# EAGLE design md2pce_v20 (EAGLE 6.6.0)
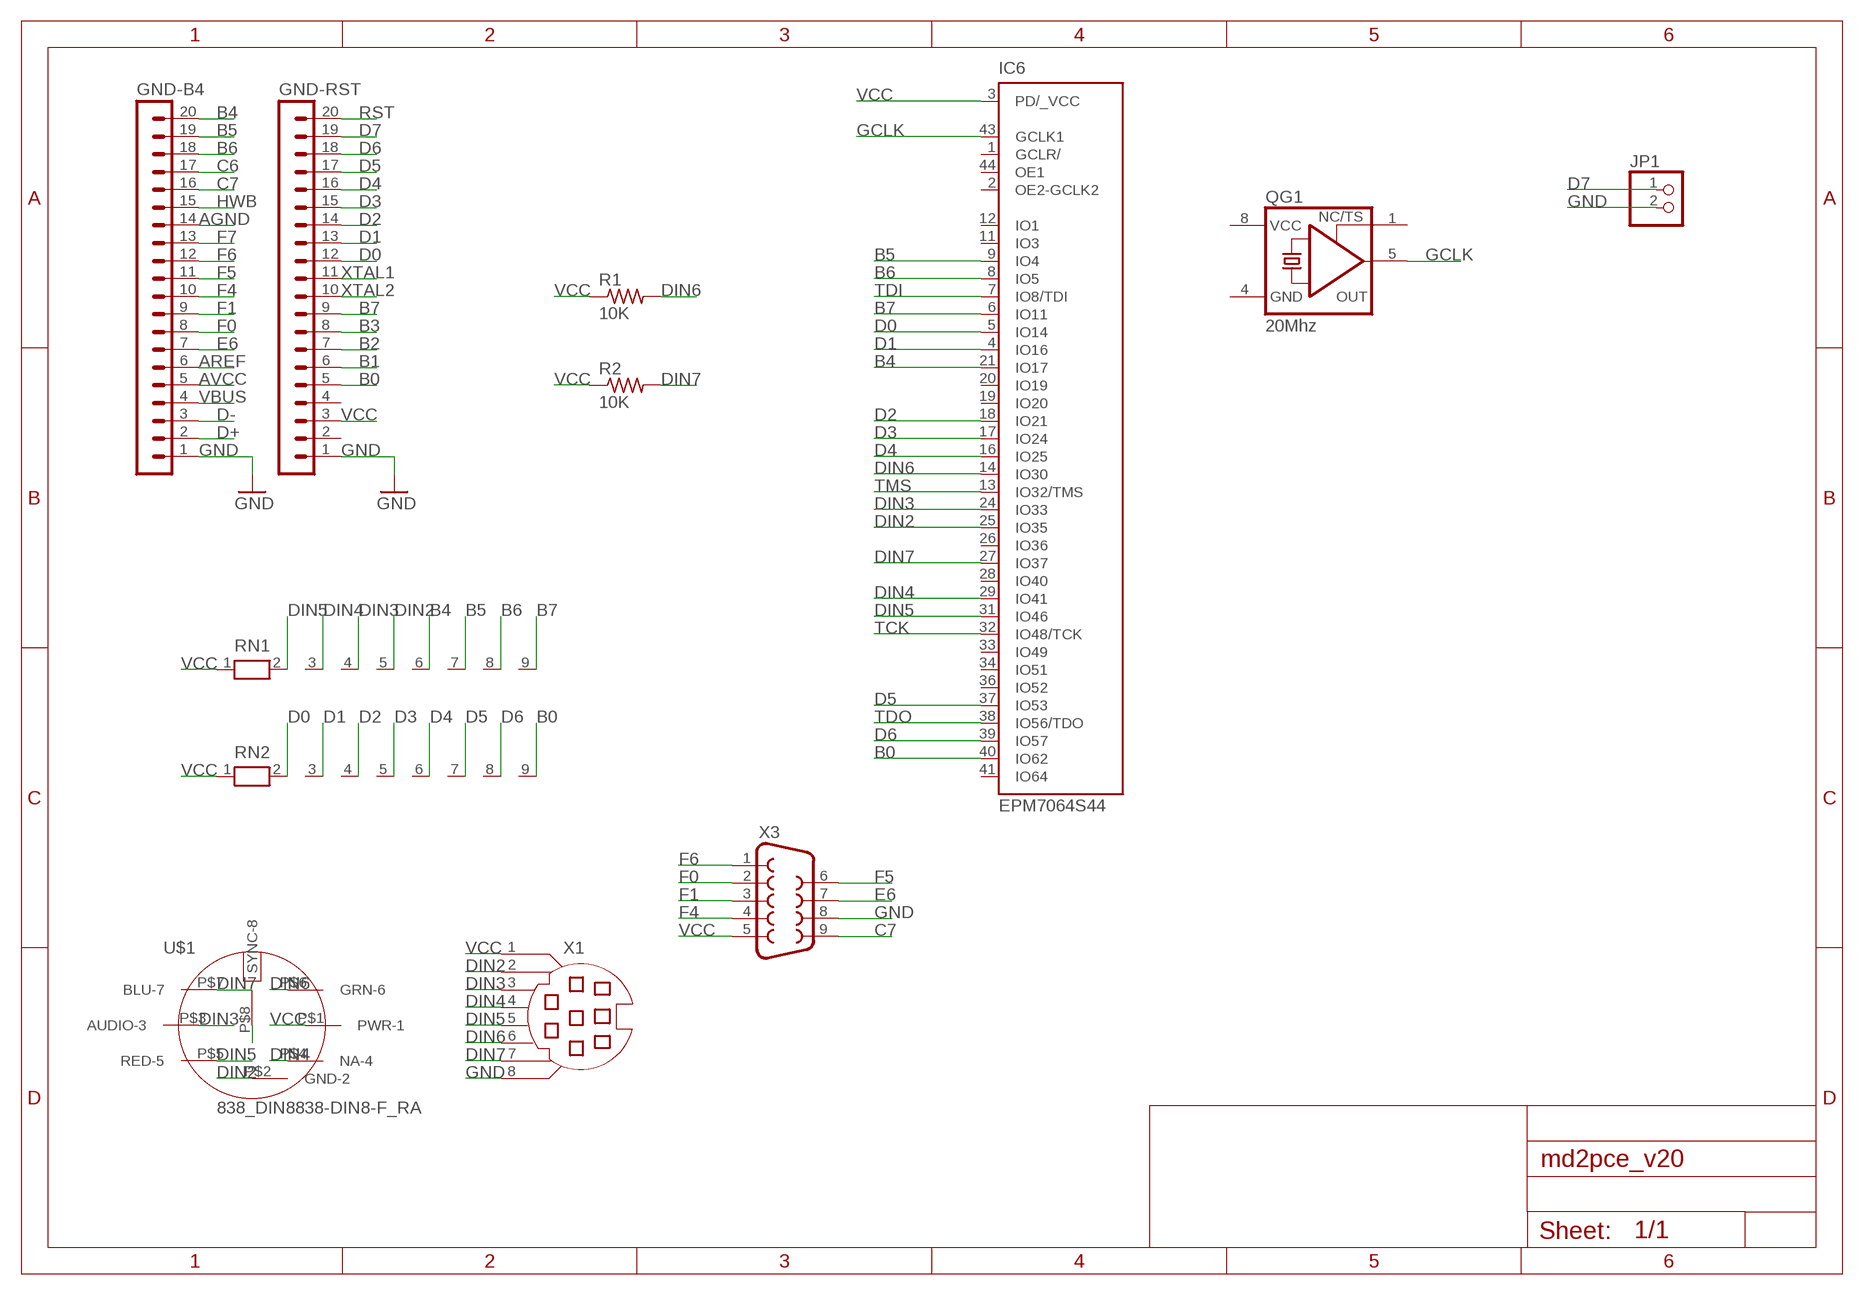
[diagram p0: schematic, sheet 1]

## Parts
GND-B4  MA20-1  [MA20-1]
GND-RST  MA20-1  [MA20-1]
IC6  EPM7064S44  [PLCC-S44]
JP1  PINHD-1X2  [1X02]
QG1  20Mhz  XO-8  [DIL08S]
R1  10K  R-US_0207/10  [0207/10]
R2  10K  R-US_0207/10  [0207/10]
RN1  RN08  [RN-9]
RN2  RN08  [RN-9]
U$1  838_DIN8838-DIN8-F_RA  [838_DIN8]
X1  MD08SS  [MDIN08SS]
X3  DB9MALE  [DB9_MALE]

## Nets
AGND: GND-B4.14
AREF: GND-B4.6
AVCC: GND-B4.5
B0: GND-RST.5 IC6.40(IO62) RN2.9
B1: GND-RST.6
B2: GND-RST.7
B3: GND-RST.8
B4: GND-B4.20 IC6.21(IO17) RN1.6
B5: GND-B4.19 IC6.9(IO4) RN1.7
B6: GND-B4.18 IC6.8(IO5) RN1.8
B7: GND-RST.9 IC6.6(IO11) RN1.9
C6: GND-B4.17
C7: GND-B4.16 X3.9
D0: GND-RST.12 IC6.5(IO14) RN2.2
D1: GND-RST.13 IC6.4(IO16) RN2.3
D2: GND-RST.14 IC6.18(IO21) RN2.4
D3: GND-RST.15 IC6.17(IO24) RN2.5
D4: GND-RST.16 IC6.16(IO25) RN2.6
D5: GND-RST.17 IC6.37(IO53) RN2.7
D6: GND-RST.18 IC6.39(IO57) RN2.8
D7: GND-RST.19 JP1.1
D+: GND-B4.2
D-: GND-B4.3
DIN2: IC6.25(IO35) RN1.5 U$1.P$2(GND-2) X1.2
DIN3: IC6.24(IO33) RN1.4 U$1.P$3(AUDIO-3) X1.3
DIN4: IC6.29(IO41) RN1.3 U$1.P$4(NA-4) X1.4
DIN5: IC6.31(IO46) RN1.2 U$1.P$5(RED-5) X1.5
DIN6: IC6.14(IO30) R1.2 U$1.P$6(GRN-6) X1.6
DIN7: IC6.27(IO37) R2.2 U$1.P$7(BLU-7) X1.7
E6: GND-B4.7 X3.7
F0: GND-B4.8 X3.2
F1: GND-B4.9 X3.3
F4: GND-B4.10 X3.4
F5: GND-B4.11 X3.6
F6: GND-B4.12 X3.1
F7: GND-B4.13
GCLK: IC6.43(GCLK1) QG1.5(OUT)
GND: GND-B4.1 GND-RST.1 JP1.2 U$1.P$8(SYNC-8) X1.8 X3.8
HWB: GND-B4.15
RST: GND-RST.20
TCK: IC6.32(IO48/TCK)
TDI: IC6.7(IO8/TDI)
TDO: IC6.38(IO56/TDO)
TMS: IC6.13(IO32/TMS)
VBUS: GND-B4.4
VCC: GND-RST.3 IC6.3(PD/_VCC) R1.1 R2.1 RN1.1 RN2.1 U$1.P$1(PWR-1) X1.1 X3.5
XTAL1: GND-RST.11
XTAL2: GND-RST.10
Unconnected: GND-RST.2 GND-RST.4 IC6.1(GCLR/) IC6.2(OE2-GCLK2) IC6.11(IO3) IC6.12(IO1) IC6.19(IO20) IC6.20(IO19) IC6.26(IO36) IC6.28(IO40) IC6.33(IO49) IC6.34(IO51) IC6.36(IO52) IC6.41(IO64) IC6.44(OE1) QG1.1(TS)

## Power pins joined to a net without a drawn wire
GND: IC6.10(GND) IC6.22(GND) IC6.30(GND) IC6.42(GND) QG1.4(GND)
VCC: IC6.15(VCC) IC6.23(VCC) IC6.35(VCC) QG1.8(VCC)

## Library data of the parts
GND-B4 GND-RST = con-lstb:MA20-1: PIN HEADER; OC_FARNELL: unknown; OC_NEWARK: unknown
IC6 = altera:EPM7064: EPM7064 MAX 7000 family; MPN: EPM7064SLC44-10N; OC_FARNELL: 1549449; OC_NEWARK: 51R0526
JP1 = pinhead:PINHD-1X2: PIN HEADER
QG1 = crystal:XO-: CRYSTAL; OC_FARNELL: unknown; OC_NEWARK: unknown
R1 R2 = rcl:R-US_: RESISTOR, American symbol
RN1 RN2 = resistor-net:RN08: RESISTOR NETWORK; OC_FARNELL: unknown; OC_NEWARK: unknown
U$1 = 838_Components:838_DIN8
X1 = con-yamaichi:MD08SS: YAMAICHI CONNECTOR; OC_FARNELL: unknown; OC_NEWARK: unknown
X3 = SparkFun:DB9: DB9 Connector Standard DB9 (D-Sub 9) serial connector. Can be used for CAN bus as well as RS485 and RS232. Footprint production proven. Spark Fun Electronics SKU : PRT-00429

## Board
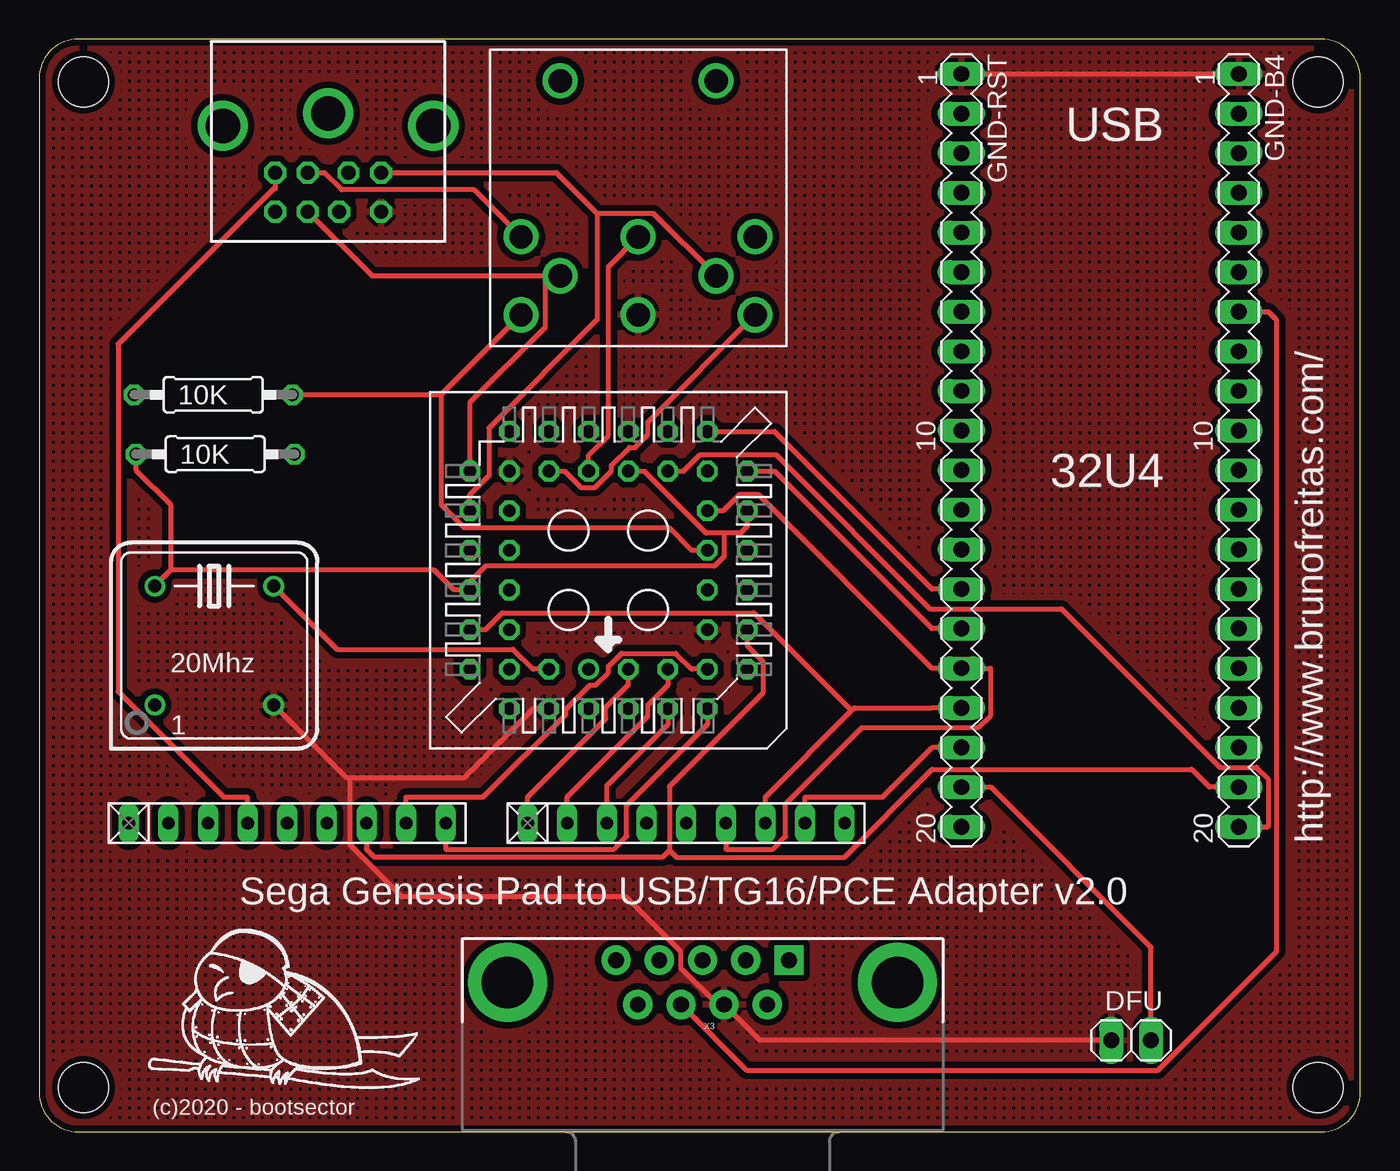
[diagram p1: board, top side]
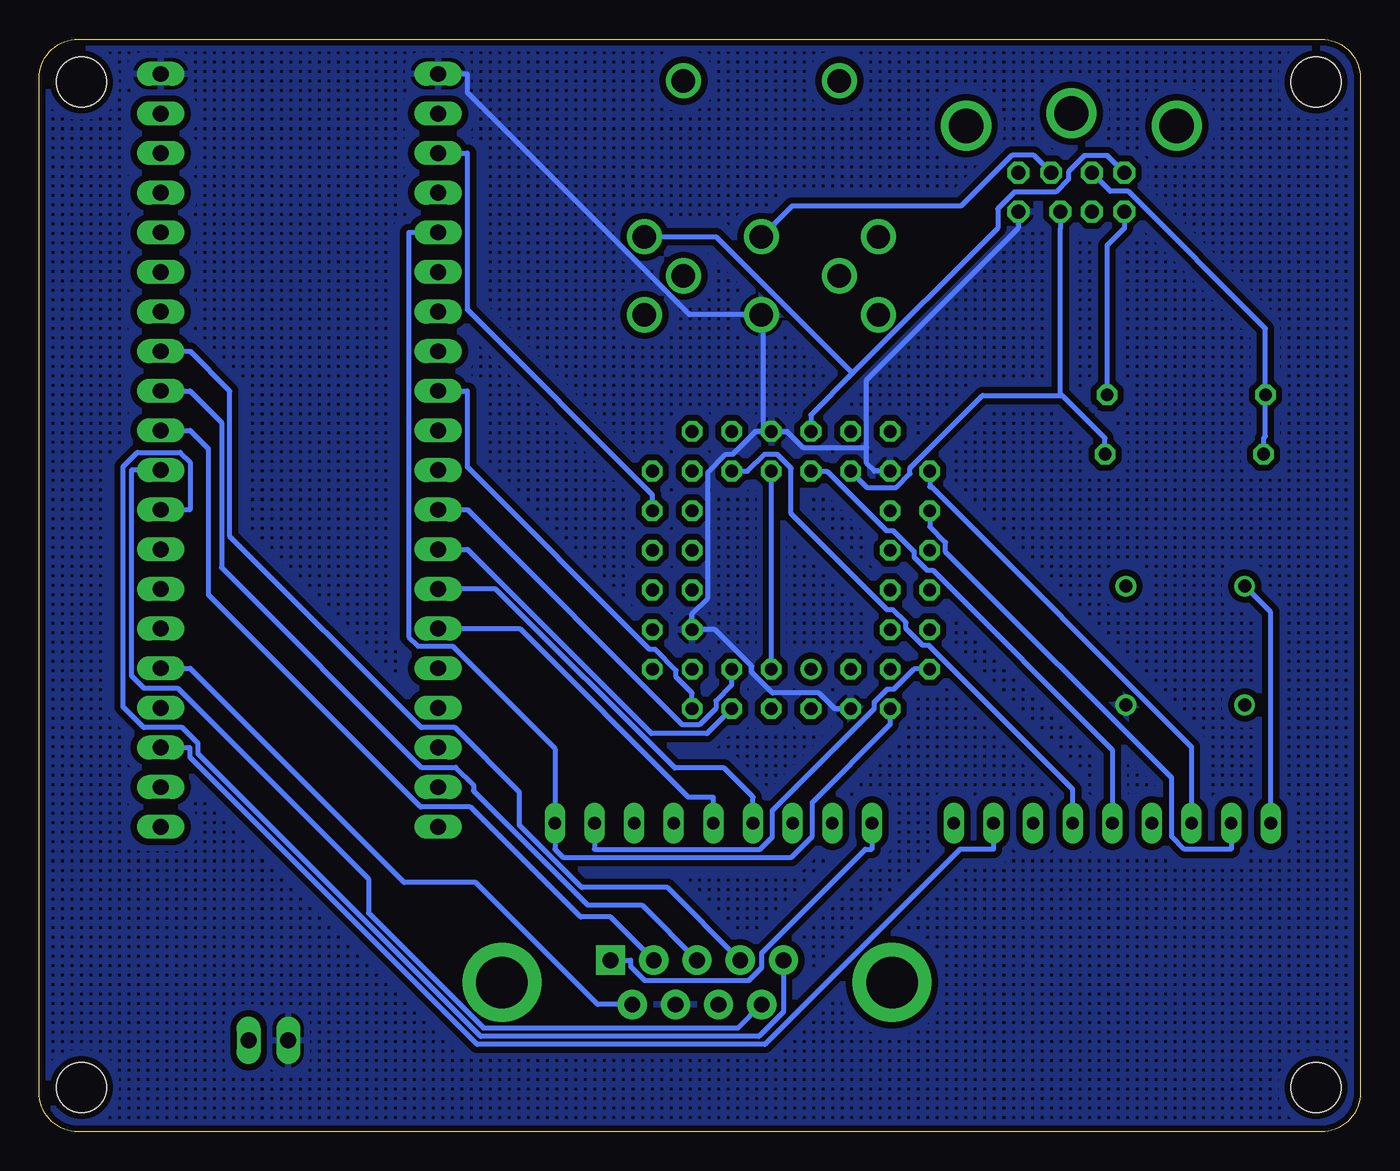
[diagram p2: board, bottom side, seen from below]

Size 84.71 x 70.06 mm. Coordinates in mm from the lower left corner, seen from the top.
Outline: 0,67.52 0,2.54 arc90 2.54,0 82.17,0 arc90 84.71,2.54 84.71,67.52 arc90 82.17,70.06 2.54,70.06 arc90 0,67.52
Copper layers (1*16): Top 0.035mm / dielectric 1.5mm / Bottom 0.035mm
Design rules "SeeedStudio_2layer_DRU_no_angle_20140221": minimum track width 6mil, minimum drill 12mil, track to track 6mil, track to pad 6mil, pad to pad 6mil, via to via 6mil, smd to smd 0mil, copper to edge 10mil, drill to drill 10mil, minimum pad ring 10mil, minimum via ring 6mil, stop-mask expansion 2mil, vias tented up to drill 100mil, thermal gap 10mil
Holes 3.2 mm at 2.85,67.3 2.85,2.85 81.99,2.85 81.99,67.3

### Footprints (pad centres in the part's own frame; a part is rotated, then mirrored left to right if it is on the bottom)
MA20-1 = drill 1.016 long: 1 -24.13,0; 2 -21.59,0; 3 -19.05,0; 4 -16.51,0; 5 -13.97,0; 6 -11.43,0; 7 -8.89,0; 8 -6.35,0; 9 -3.81,0; 10 -1.27,0; 11 1.27,0; 12 3.81,0; 13 6.35,0; 14 8.89,0; 15 11.43,0; 16 13.97,0; 17 16.51,0; 18 19.05,0; 19 21.59,0; 20 24.13,0
PLCC-S44 = drill 0.813: 1 1.27,6.35 | drill 0.813 octagon: 2 -1.27,8.89; 3 -1.27,6.35; 4 -3.81,8.89; 5 -3.81,6.35; 6 -6.35,8.89; 7 -8.89,6.35; 8 -6.35,6.35; 9 -8.89,3.81; 10 -6.35,3.81; 11 -8.89,1.27; 12 -6.35,1.27; 13 -8.89,-1.27; 14 -6.35,-1.27; 15 -8.89,-3.81; 16 -6.35,-3.81; 17 -8.89,-6.35; 18 -6.35,-8.89; 19 -6.35,-6.35; 20 -3.81,-8.89; 21 -3.81,-6.35; 22 -1.27,-8.89; 23 -1.27,-6.35; 24 1.27,-8.89; 25 1.27,-6.35; 26 3.81,-8.89; 27 3.81,-6.35; 28 6.35,-8.89; 29 8.89,-6.35; 30 6.35,-6.35; 31 8.89,-3.81; 32 6.35,-3.81; 33 8.89,-1.27; 34 6.35,-1.27; 35 8.89,1.27; 36 6.35,1.27; 37 8.89,3.81; 38 6.35,3.81; 39 8.89,6.35; 40 6.35,8.89; 41 6.35,6.35; 42 3.81,8.89; 43 3.81,6.35; 44 1.27,8.89
1X02 = drill 1.016 long: 1 -1.27,0; 2 1.27,0
DIL08S = drill 0.813: 1 -3.81,-3.81; 4 3.81,-3.81; 5 3.81,3.81; 8 -3.81,3.81
0207/10 = drill 0.813 octagon: 1 -5.08,0; 2 5.08,0
RN-9 = drill 0.813 long: 1 -10.16,0; 2 -7.62,0; 3 -5.08,0; 4 -2.54,0; 5 0,0; 6 2.54,0; 7 5.08,0; 8 7.62,0; 9 10.16,0
838_DIN8 = drill 1.5: P$1 7.5,-5; P$2 0,-5; P$3 -7.5,-5; P$4 5,-2.5; P$5 -5,-2.5; P$6 7.5,0; P$7 -7.5,0; P$8 0,0; P$9 5,-15; P$10 -5,-15
MDIN08SS = drill 0.9 octagon: 1 1.3,8.5; 2 -1.3,8.5; 3 3.4,8.5; 4 1.3,11; 5 -3.4,8.5; 6 3.4,11; 7 -0.7,11; 8 -3.4,11 | drill 2.2: P$1 -6.75,5.5; P$2 0,4.7; P$3 6.75,5.5
DB9_MALE = drill 1.016 pad 1.88: 1 5.54,-1.42; 2 2.77,-1.42; 3 0,-1.42; 4 -2.77,-1.42; 6 4.15,1.42; 7 1.38,1.42; 8 -1.38,1.42; 9 -4.15,1.42 | drill 1.016 pad 1.88 square: 5 -5.54,-1.42 | drill 3.302 pad 5.08: G1 -12.5,0; G2 12.5,0

### Placement (x,y rotation side)
GND-B4  76.91,43.69 270 top
GND-RST  59.13,43.69 270 top
IC6  36.5,36.01 180 top
JP1  70.01,5.87 180 top
QG1  11.23,31.18 0 top
R1  11.17,47.26 0 top
R2  11.29,43.45 0 top
RN1  15.91,19.8 0 top
RN2  41.48,19.8 0 top
U$1  38.4,52.38 180 top
X1  18.53,70 180 top
X3  42.53,9.59 180 top

### Tracks (layer width: path | path; a pad name or v marks a point on that pad's centre or on a via)
B0
  Bottom 0.305: IC6.40 30.15,26.11 35.13,21.12 35.13,18.95 36.48,17.6 51.12,17.6 51.64,18.12 RN2.9 51.64,24.58 58.21,31.14 60.42,31.14 61.01,31.74 61.01,57.66 GND-RST.5
B4
  Top 0.305: GND-B4.20 78.79,19.56 78.79,22.62 78.04,23.37 75.69,23.37 65.53,33.53 57.12,33.53 47.24,43.41 42.38,43.41 41.33,42.36 IC6.21
  Bottom 0.305: IC6.21 39.29,42.36 38.22,43.43 37.38,43.43 36.5,42.55 36.5,39.63 30.34,33.47 29.96,33.47 29.13,32.64 29.13,32.27 28.05,31.19 27.67,31.19 18.45,21.96 RN1.6
B5
  Top 0.305: 40.41,18.06 40.85,17.61 51.62,17.61 57.25,23.24 73.89,23.24 75.03,22.1 GND-B4.19 | 40.41,18.06 39.96,17.61 21.5,17.61 20.99,18.12 RN1.7 | 40.41,18.06 40.41,22.14 46.41,28.14 46.41,30.17 45.39,31.19 IC6.9
B6
  Top 0.305: IC6.8 41.83,29.66 40.81,30.68 37.34,30.68 36.5,29.84 36.5,29.46 35.68,28.65 35.31,28.65 33.78,27.11 33.78,26.77 28.48,21.47 23.53,21.47 RN1.8
  Bottom 0.305: GND-B4.18 75.03,24.64 75.03,24.01 56.63,5.61 38.18,5.61 25.67,18.12 23.53,18.12 RN1.8
B7
  Top 0.305: IC6.6 42.85,26.11 37.67,20.93 37.67,18.94 36.85,18.12 26.07,18.12 RN1.9
  Bottom 0.305: GND-RST.9 57.25,47.5 57.25,42.6 45.58,30.93 45.2,30.93 43.87,29.6 43.87,29.15 42.85,28.14 IC6.6
C7
  Bottom 0.305: GND-B4.16 75.03,29.72 61.3,15.99 56.72,15.99 48.9,8.17 X3.9
D0
  Top 0.305: IC6.5 40.31,28.65 39.04,27.38 39.04,26.65 33.86,21.47 RN2.2
  Bottom 0.305: GND-RST.12 57.25,39.88 43.47,26.1 42.38,26.1 41.33,27.16 41.33,27.63 40.31,28.65 IC6.5
D1
  Top 0.305: IC6.4 40.31,26.11 36.4,22.2 RN2.3
  Bottom 0.305: GND-RST.13 57.25,37.34 45.45,25.54 41.89,25.54 IC6.4
D2
  Top 0.305: GND-RST.14 57.25,34.8 47.15,44.9 IC6.18
  Bottom 0.305: RN2.4 38.94,21.47 40.8,23.33 43.95,23.33 55.43,34.8 GND-RST.14
D3
  Top 0.305: IC6.17 47.15,42.36 57.25,32.26 GND-RST.15
  Bottom 0.305: RN2.5 41.48,21.47 43.09,21.47 53.88,32.26 GND-RST.15
D4
  Top 0.305: IC6.16 43.87,39.82 44.9,40.85 46.12,40.85 57.25,29.72 GND-RST.16 59.28,29.72 61.01,29.72 61.01,26.7 60.22,25.91 52.75,25.91 47.86,21.03 47.86,18.94 47.05,18.12 44.02,18.12 RN2.6
D5
  Top 0.305: 52.09,27 52.27,27.18 57.25,27.18 GND-RST.17 | 52.09,27 46.56,21.47 RN2.7 | 52.09,27 45.83,33.27 29.69,33.27 28.63,32.2 IC6.37
D6
  Top 0.305: GND-RST.18 57.25,24.64 54.08,21.47 49.1,21.47 RN2.8
  Bottom 0.305: IC6.39 28.63,29.66 29.9,28.39 30.34,28.39 31.17,27.56 31.17,27.14 37.7,20.6 37.7,18.9 38.49,18.12 49.1,18.12 RN2.8
D7
  Top 0.305: GND-RST.19 61.01,22.1 71.28,11.83 JP1.1
DIN2
  Top 0.305: U$1.P$2 36.5,55.48 36.5,44.65 35.23,43.38 IC6.25
  Bottom 0.305: IC6.25 34.21,42.36 30.4,38.55 29.96,38.55 28.63,37.22 28.63,36.84 27.8,36.01 27.42,36.01 15.91,24.5 RN1.5 | X1.2 20.94,62.61 22.35,62.61 25.6,59.35 36.43,59.35 U$1.P$2
DIN3
  Top 0.305: RN1.4 13.37,21.47 11.83,21.47 5.07,28.23 5.07,50.51 15,60.44 15.13,60.44 X1.3
  Bottom 0.305: 32.56,48.63 35.23,45.96 IC6.24 | X1.3 16.22,62.59 17.69,62.59 18.72,61.55 18.72,61.06 19.54,60.25 22.19,60.25 23.25,59.18 23.25,57.94 32.56,48.63 | U$1.P$3 41.31,57.38 32.56,48.63
DIN4
  Top 0.305: 32.45,54.88 U$1.P$4 | X1.4 21.35,54.88 32.45,54.88 | 32.45,54.88 32.45,51.58 27.61,46.74 IC6.29
  Bottom 0.305: IC6.29 27.61,41.35 27.48,41.35 10.83,24.69 RN1.3
DIN5
  Top 0.305: 35.78,58.88 35.78,52.06 28.85,45.12 28.85,42.08 27.61,40.84 IC6.31 | 35.78,58.88 33.16,61.5 22.99,61.5 X1.5 | U$1.P$5 39.41,58.88 35.78,58.88
  Bottom 0.305: IC6.31 27.61,38.81 26.59,37.79 26.59,37.19 12.1,22.7 12.1,18.94 11.29,18.12 8.29,18.12 RN1.2
DIN6
  Top 0.305: 25.78,47.26 U$1.P$6 | R1.2 25.78,47.26 | 25.78,47.26 25.78,40.21 27.26,38.73 40.38,38.73 41.83,37.28 IC6.14
  Bottom 0.305: X1.6 15.13,57.94 16.25,56.82 R1.2
DIN7
  Top 0.305: IC6.27 33.71,42.36 34.76,41.31 35.63,41.31 36.7,42.38 36.7,42.75 37.84,43.89 38.22,43.89 39.04,44.71 39.04,45.52 U$1.P$7
  Bottom 0.305: 19.23,47.21 19.12,47.21 16.37,44.47 R2.2 | IC6.27 31.64,41.32 29.75,41.32 28.88,42.19 28.88,42.56 24.23,47.21 19.23,47.21 | 19.23,47.21 19.23,57.94 X1.7
E6
  Top 0.305: GND-B4.7 78.79,52.58 79.34,52.03 79.34,11.58 71.73,3.96 45.36,3.96 X3.7
F0
  Bottom 0.305: GND-B4.8 75.03,50.04 72.48,47.49 72.48,38.17 60.22,25.91 58.05,25.91 53.91,21.77 53.91,19.65 49.93,15.67 44.43,15.67 X3.2
F1
  Bottom 0.305: X3.3 46.07,14.54 49.54,14.54 56.87,21.87 56.87,22.25 57.99,23.37 60.21,23.37 73.02,36.18 73.02,45.49 75.03,47.5 GND-B4.9
F4
  Bottom 0.305: GND-B4.10 75.03,44.96 73.84,43.78 73.84,34.43 60.25,20.83 57.05,20.83 50,13.78 48.08,13.78 X3.4
F5
  Bottom 0.305: X3.6 39.89,6.66 56.22,6.66 63.58,14.03 63.58,16.2 75.83,28.45 78,28.45 78.79,29.25 78.79,42.42 GND-B4.11
F6
  Bottom 0.305: GND-B4.12 75.03,39.88 75.03,42.93 75.66,43.56 78.41,43.56 79.32,42.65 79.32,27.23 78,25.91 75.52,25.91 74.52,24.91 74.52,24.24 56.4,6.12 38.57,6.12 36.99,7.7 X3.1
GCLK
  Top 0.305: IC6.43 31.67,29.66 30.4,30.93 19.1,30.93 QG1.5
GND
  Top 0.305: JP1.2 46.21,5.87 X3.8 43.48,8.17 41.15,10.5 41.15,11.53 37.62,15.06 23.28,15.06 19.94,18.39 19.94,22.69 | 19.94,22.69 19.72,22.69 QG1.4 | 19.94,22.69 27.24,22.69 31.67,27.12 IC6.42 | GND-RST.1 GND-B4.1
  Bottom 0.305: IC6.42 33.71,27.12 34.72,28.14 37.69,28.14 39.04,29.49 39.04,29.86 41.38,32.2 IC6.10 42.85,33.22 41.83,34.23 41.83,42.28 40.66,43.45 40.24,43.45 38.79,44.9 38.28,44.9 | 38.28,44.9 38.28,52.25 U$1.P$8 43.01,52.38 57.25,66.63 57.25,67.82 GND-RST.1 | 38.28,44.9 IC6.22 36.75,44.9 35.74,43.89 31.66,43.89 | 31.66,43.89 31.66,48.21 21.93,57.94 X1.8 | 31.66,43.89 31.66,42.85 31.17,42.36 IC6.30
  pour Top (isolate 0.406, hatched): 0.17,70.55 85.01,70.55 85.01,0 0.17,0
  pour Bottom (isolate 0.406, hatched): 0,70.71 85.01,70.71 85.01,-0.35 0,-0.35
VCC
  Top 0.305: 43.91,38.38 42.77,38.38 38.79,42.36 IC6.23 | 43.91,38.38 44.96,38.38 45.39,38.81 IC6.15 | 43.91,38.38 43.91,36.89 43.29,36.27 28.63,36.27 27.1,34.74 | 27.1,34.74 26.59,34.74 25.33,36.01 8.44,36.01 | IC6.35 27.1,34.74 | R2.1 6.21,42.43 8.44,40.21 8.44,36.01 | 8.44,36.01 QG1.8 | IC6.3 37.77,28.65 36.32,27.2 36.32,26.47 31.32,21.47 RN2.1 | X1.1 18.29,61.5 19.39,60.4 27.89,60.4 U$1.P$1
  Bottom 0.305: RN2.1 31.32,18.12 31.74,18.12 38.38,11.48 38.38,10.54 39.21,9.71 45.89,9.71 46.78,10.6 46.78,11.01 X3.5 | IC6.3 IC6.23 | R2.1 6.21,44.47 6.09,44.59 R1.1 6.09,51.51 14.89,60.3 16.04,60.3 X1.1 | GND-RST.3 57.25,62.74 57.25,52.7 45.39,40.84 IC6.15 | RN1.1 5.75,33.32 QG1.8

### Text on the board
tPlace: USB | 32U4 | http://www.brunofreitas.com/ | Sega Genesis Pad to USB/TG16/PCE Adapter v2.0 | DFU | (c)2020 - bootsector